# Altium schematic sheet DS_NEW.SchDoc
size A3
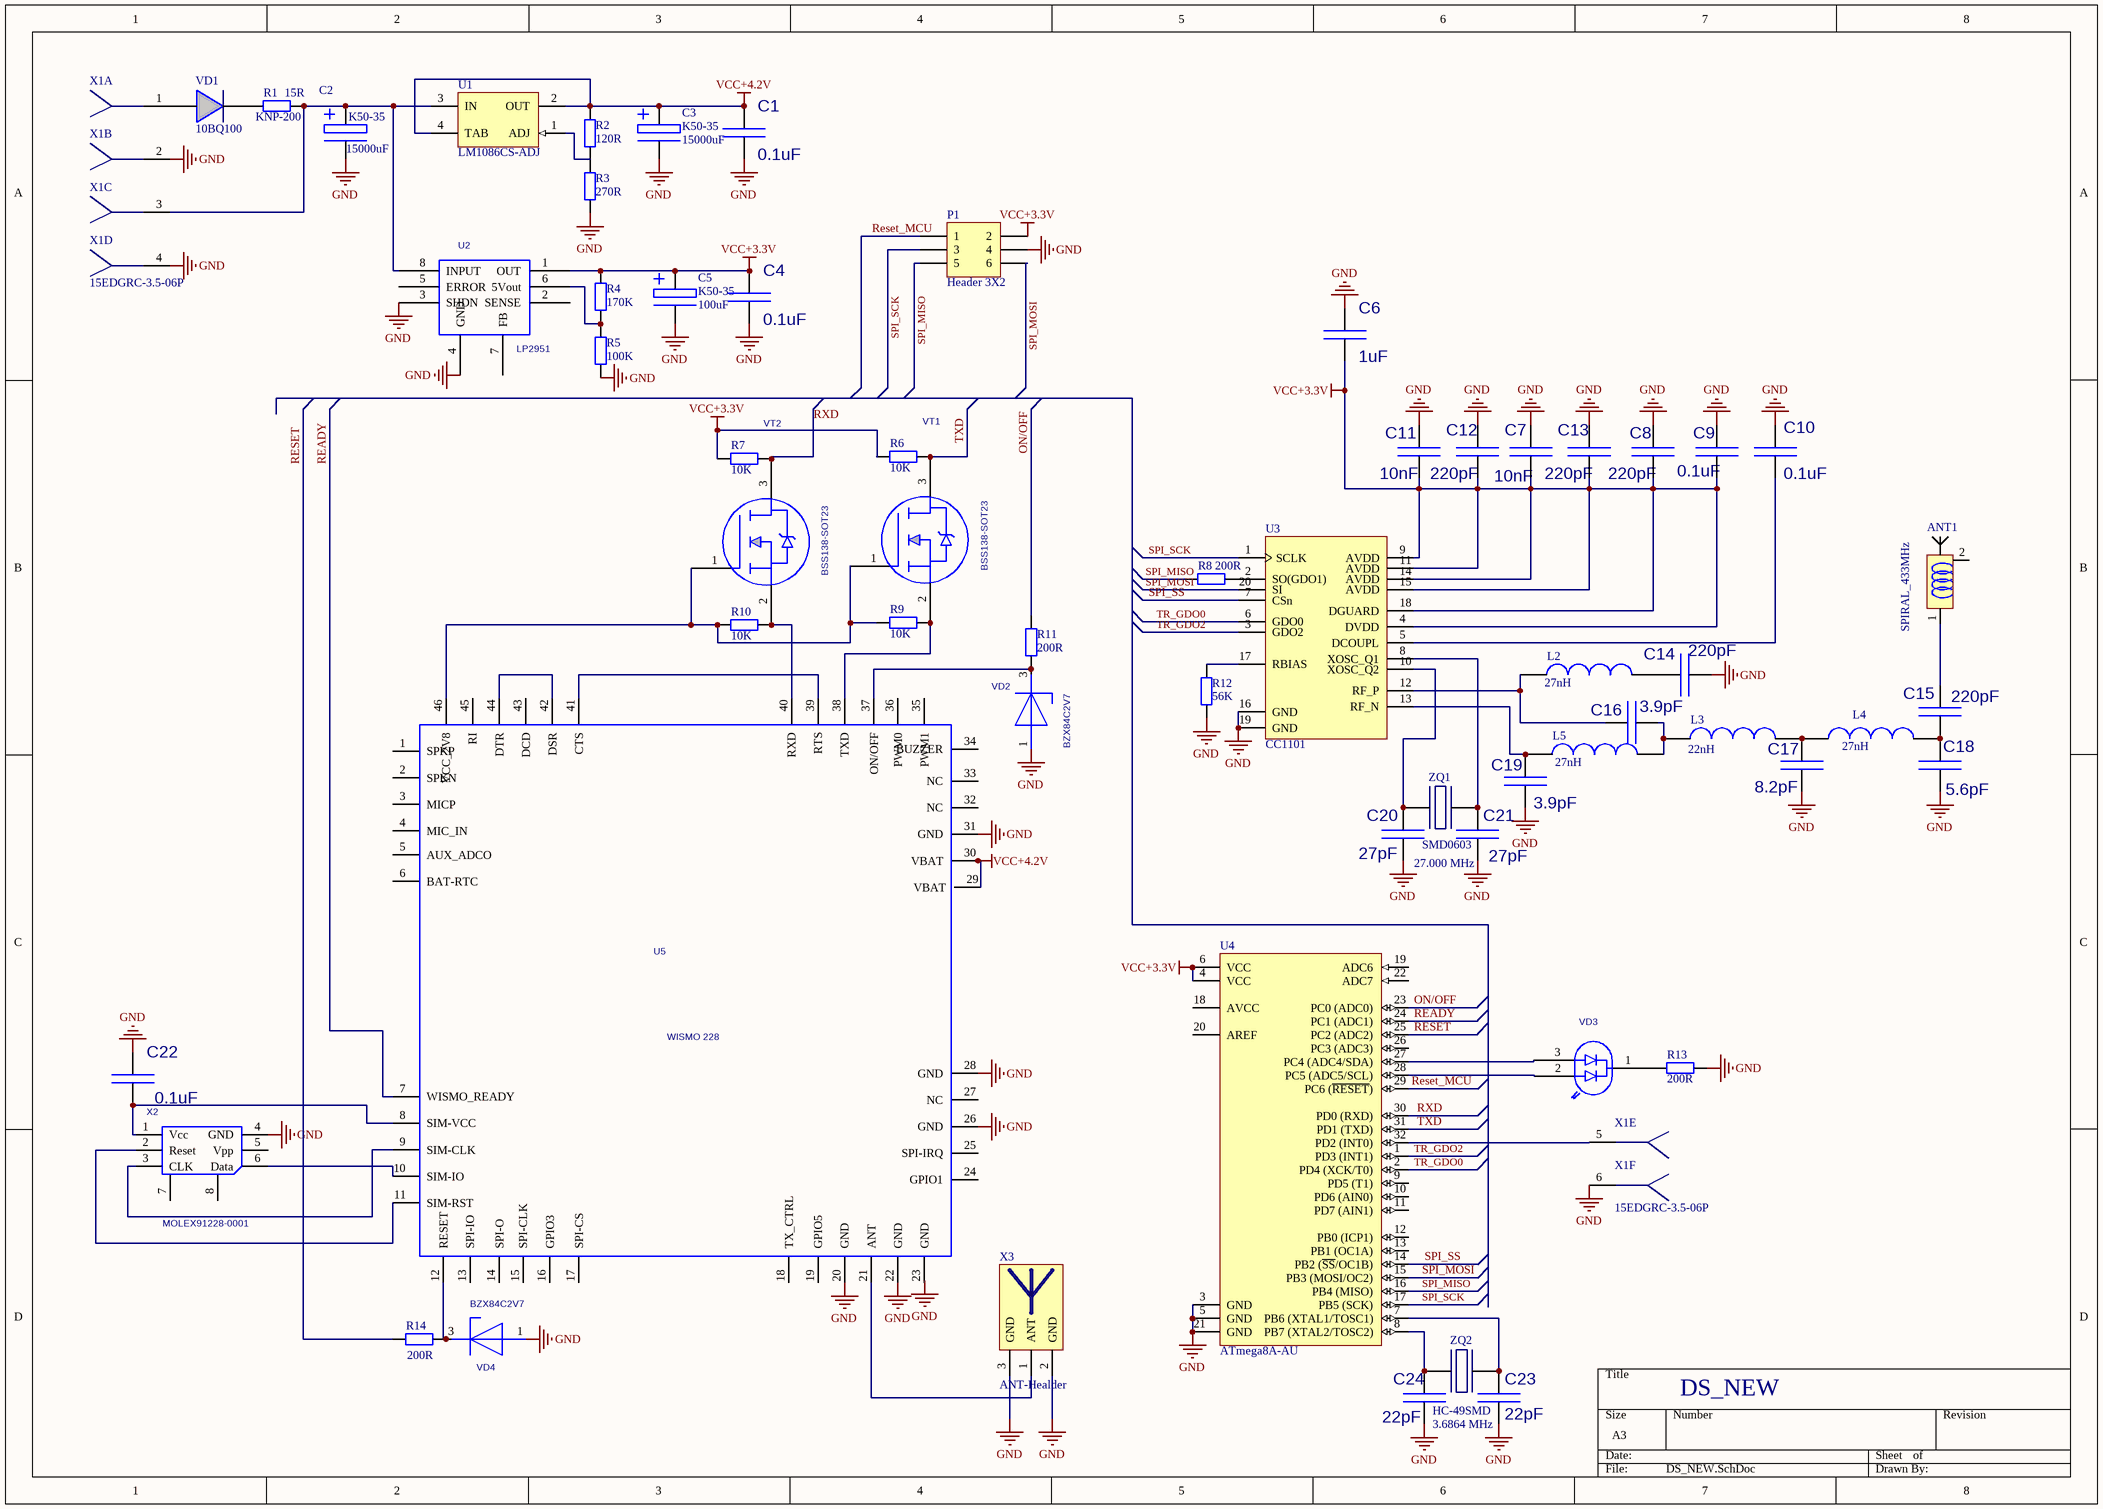
[diagram p0: DS_NEW.SchDoc]

## Parts
ANT1  SPIRAL_433MHz  [ANT_433MHz_SPIRAL]
C1  value 0.1uF  [C0805]  (hidden comment: KONDENS_SMD)
C2  K50-35  [CAP_POL_D18-Horizontal]
C3  K50-35  [CAP_POL_D18-Horizontal]
C4  value 0.1uF  [C0805]  (hidden comment: KONDENS_SMD)
C5  K50-35  value 100uF  [CAP_POL_D6.3]
C6  value 1uF  [C0805]  (hidden comment: KONDENS_SMD)
C7  value 10nF  [C0805]  (hidden comment: KONDENS_SMD)
C8  value 220pF  [C0805]  (hidden comment: KONDENS_SMD)
C9  value 0.1uF  [C0805]  (hidden comment: KONDENS_SMD)
C10  value 0.1uF  [C0805]  (hidden comment: KONDENS_SMD)
C11  value 10nF  [C0805]  (hidden comment: KONDENS_SMD)
C12  value 220pF  [C0805]  (hidden comment: KONDENS_SMD)
C13  value 220pF  [C0805]  (hidden comment: KONDENS_SMD)
C14  value 220pF  [C0805]  (hidden comment: KONDENS_SMD)
C15  value 220pF  [C0805]  (hidden comment: KONDENS_SMD)
C16  value 3.9pF  [C0805]  (hidden comment: KONDENS_SMD)
C17  value 8.2pF  [C0805]  (hidden comment: KONDENS_SMD)
C18  value 5.6pF  [C0805]  (hidden comment: KONDENS_SMD)
C19  value 3.9pF  [C0805]  (hidden comment: KONDENS_SMD)
C20  value 27pF  [C0805]  (hidden comment: KONDENS_SMD)
C21  value 27pF  [C0805]  (hidden comment: KONDENS_SMD)
C22  value 0.1uF  [C0805]  (hidden comment: KONDENS_SMD)
C23  value 22pF  [C0805]  (hidden comment: KONDENS_SMD)
C24  value 22pF  [C0805]  (hidden comment: KONDENS_SMD)
L2  value 27nH  [6-0805_M]  (hidden comment: SMD_0805)
L3  value 22nH  [6-0805_M]  (hidden comment: SMD_0805)
L4  value 27nH  [6-0805_M]  (hidden comment: SMD_0805)
L5  value 27nH  [6-0805_M]  (hidden comment: SMD_0805)
P1  Header 3X2  [HDR2X3]
R1  KNP-200  [Resistor KNP-200]
R2  value 120R  [C0805]  (hidden comment: RES)
R3  value 270R  [C0805]  (hidden comment: RES)
R4  value 170K  [C0805]  (hidden comment: RES)
R5  value 100K  [C0805]  (hidden comment: RES)
R6  value 10K  [C0805]  (hidden comment: RES)
R7  value 10K  [C0805]  (hidden comment: RES)
R8  value 200R  [C0805]  (hidden comment: RES)
R9  value 10K  [C0805]  (hidden comment: RES)
R10  value 10K  [C0805]  (hidden comment: RES)
R11  value 200R  [C0805]  (hidden comment: RES)
R12  value 56K  [C0805]  (hidden comment: RES)
R13  value 200R  [C0805]  (hidden comment: RES)
R14  value 200R  [C0805]  (hidden comment: RES)
U1  LM1086CS-ADJ  [TS3B_M]
U2  LP2951  [SOIC-8]
U3  CC1101  [VQFN20]
U4  ATmega8A-AU  [32A_N]
U5  WISMO 228  [WISMO]
VD1  10BQ100  [SMB]
VD2  BZX84C2V7  [SOT23]
VD3  LIGHTDIODE2  [LIGHTDIODE2]  (value not drawn)
VD4  BZX84C2V7  [SOT23]
VT1  BSS138-SOT23  [SOT23]
VT2  BSS138-SOT23  [SOT23]
X1  15EDGRC-3.5-06P  [15EDGRC-3.5-06P]  (value not drawn)  (parts A,B,C,D,E,F of 6)
X2  MOLEX91228-0001  [MOLEX91228-0001]
X3  ANT-Healder  [ANT-Healder]
ZQ1  SMD0603  value 27.000 MHz  [Quartz_SMD0603]
ZQ2  HC-49SMD  value 3.6864 MHz  [HC-49SMD]

## Nets
GND: C1.2(B) C2.2(MINUS) C3.2(MINUS) C4.2(B) C5.2(MINUS) C6.1(A) C7.1(A) C8.1(A) C9.1(A) C10.1(A) C11.1(A) C12.1(A) C13.1(A) C14.2(B) C17.2(B) C18.2(B) C19.2(B) C20.2(B) C21.2(B) C22.1(A) C23.2(B) C24.2(B) P1.4 R3.1 R5.1 R12.1 R13.1 U2.3(SHDN) U2.4(GND) U3.16(GND) U3.19(GND) U4.3(GND) U4.5(GND) U4.21(GND) U5.20(GND) U5.22(GND) U5.26(GND) U5.28(GND) U5.31(GND) VD2.1 VD4.1 X1.2 X1.4 X1.6 X2.4(GND) X3.2(GND) X3.3(GND)
VCC+3.3V: C4.1(A) C5.1(PLUS) C6.2(B) C7.2(B) C8.2(B) C9.2(B) C11.2(B) C12.2(B) C13.2(B) P1.2 R4.2 R6.2 R7.2 U2.1(OUT) U3.4(DVDD) U3.9(AVDD) U3.11(AVDD) U3.14(AVDD) U3.15(AVDD) U3.18(DGUARD) U4.4(VCC) U4.6(VCC)
VCC+4.2V: C1.1(A) C3.1(PLUS) R2.2 U1.2(OUT) U1.4(TAB) U5.29(VBAT) U5.30(VBAT)
ON/OFF: R11.2 U4.23(PC0_(ADC0))
READY: U4.24(PC1_(ADC1)) U5.7(WISMO_READY)
RESET: R14.2 U4.25(PC2_(ADC2))
Reset_MCU: P1.1 U4.29(PC6_(~{RESET}))
RXD: R7.1 U4.30(PD0_(RXD)) VT2.3(Drain)
SPI_MISO: P1.5 R8.2 U4.16(PB4_(MISO))
SPI_MOSI: P1.6 U3.20(SI) U4.15(PB3_(MOSI/OC2))
SPI_SCK: P1.3 U3.1(SCLK) U4.17(PB5_(SCK))
SPI_SS: U3.7(CSn) U4.14(PB2_(~{SS}/OC1B))
TR_GDO0: U3.6(GDO0) U4.2(PD4_(XCK/T0))
TR_GDO2: U3.3(GDO2) U4.1(PD3_(INT1))
TXD: R6.1 U4.31(PD1_(TXD)) VT1.3(Drain)
NetANT1_1: ANT1.1 C15.1(A)
NetC2_1: C2.1(PLUS) R1.2 U1.3(IN) U2.8(INPUT) X1.3
NetC10_2: C10.2(B) U3.5(DCOUPL)
NetC14_1: C14.1(A) L2.2
NetC15_2: C15.2(B) C18.1(A) L4.2
NetC16_1: C16.1(A) L2.1 U3.12(RF_P)
NetC16_2: C16.2(B) L3.1 L5.2
NetC17_1: C17.1(A) L3.2 L4.1
NetC19_1: C19.1(A) L5.1 U3.13(RF_N)
NetC20_1: C20.1(A) U3.10(XOSC_Q2) ZQ1.3
NetC21_1: C21.1(A) U3.8(XOSC_Q1) ZQ1.1
NetC22_2: C22.2(B) U5.8(SIM-VCC) X2.1(Vcc)
NetC23_1: C23.1(A) U4.7(PB6_(XTAL1/TOSC1)) ZQ2.1
NetC24_1: C24.1(A) U4.8(PB7_(XTAL2/TOSC2)) ZQ2.2
NetR1_1: R1.1 VD1.1
NetR3_2: R3.2 U1.1(ADJ)
NetR4_1: R4.1 R5.2 U2.6(5Vout)
NetR8_1: R8.1 U3.2(SO(GDO1))
NetR9_1: R9.1 U5.38(TXD) VT1.2(Source)
NetR9_2: R9.2 R10.2 U5.46(VCC_2V8) VT1.1(Gate) VT2.1(Gate)
NetR10_1: R10.1 U5.40(RXD) VT2.2(Source)
NetR11_1: R11.1 U5.37(ON/OFF) VD2.3
NetR12_2: R12.2 U3.17(RBIAS)
NetR13_2: R13.2 VD3.1
NetR14_1: R14.1 U5.12(RESET) VD4.3
NetU4_27: U4.27(PC4_(ADC4/SDA)) VD3.3
NetU4_28: U4.28(PC5_(ADC5/SCL)) VD3.2
NetU4_32: U4.32(PD2_(INT0)) X1.5
NetU5_9: U5.9(SIM-CLK) X2.3(CLK)
NetU5_10: U5.10(SIM-IO) X2.6(Data)
NetU5_11: U5.11(SIM-RST) X2.2(Reset)
NetU5_21: U5.21(ANT) X3.1(ANT)
NetU5_39: U5.39(RTS) U5.41(CTS)
NetU5_42: U5.42(DSR) U5.44(DTR)
NetVD1_2: VD1.2 X1.1

Not connected (* = marked no-connect by the designer): ANT1 2; R2 1; U2 2(SENSE) 5(ERROR) 7(FB); U4 9(PD5_(T1)) 10(PD6_(AIN0)) 11(PD7_(AIN1)) 12(PB0_(ICP1)) 13(PB1_(OC1A)) 18(AVCC) 19(ADC6) 20(AREF) 22(ADC7) 26(PC3_(ADC3)); U5 1(SPKP) 2(SPKN) 3(MICP) 4(MIC_IN) 5(AUX_ADCO) 6(BAT-RTC) 13(SPI-IO) 14(SPI-O) 15(SPI-CLK) 16(GPIO3) 17(SPI-CS) 18(TX_CTRL) 19(GPIO5) 23(GND) 24(GPIO1) 25(SPI-IRQ) 27(NC) 32(NC) 33(NC) 34(BUZZER) 35(PWM1) 36(PWM0) 43(DCD) 45(RI); VD2 2; VD4 2; X2 5(Vpp) 7(0) 8(1)

## Notes on the sheet
- DS_NEW
- Labels drawn without touching a wire or pin: GND
- (in symbol Capasitor _pol D18) 15000uF
- (in symbol Resistor 2W) 15R

## Library data of the parts
ANT1 = ANT_433MHz_SPIRAL
C2 C3 = Capasitor _pol D18
C5 = Capasitor_pol D6.3
L2-L5 = Induktor_0805
P1 = Header 3X2: Header, 3-Pin, Dual row; LatestRevisionDate: 17-Jul-2002; LatestRevisionNote: Re-released for DXP Platform.; Publisher: Altium Limited
R1 = Resistor 2W
R2-R14 = RES: Resistor
U1 = LM1086CS-ADJ: 1.5A Low Dropout Positive Regulators, 3-pin TO-263; Manufacturer: National Semiconductor; PackageTopMarking: NSUZXYTTE#*LM1086*CS-ADJ; PowerWise: N; CompType: LDO IC; Published: 4-Dec-2008; DatasheetVersion: Jun-2005; PackageVersion: revF, Apr-2005; PackageReference: TS3B; Publisher: Altium Limited; PackageDescription: TO-263, Molded, .400 x .390 x .180in, 3 Lead, .1in Pitch, Surface Mount; Supplier 1: Farnell; Supplier Part Number 1: 9489975; PartNumber: LM1086CS-ADJ; RoHS: N; PinCount: 3; Code_JEDEC: MO-169-AA; ComponentLink1Description: LM1086 Datasheet; ComponentLink1URL: http://www.national.com/ds/LM/LM1086.pdf; ComponentLink2Description: LM1086 Web Page; ComponentLink2URL: http://www.national.com/pf/LM/LM1086.html; ComponentLink3Description: TS3B Package Page; ComponentLink3URL: http://www.national.com/packaging/folders/ts3b.html
U4 = ATmega8A-AU: 8-bit AVR Microcontroller, 8KB Flash, 512 Bytes EEPROM, 1KB SRAM, 32-pin TQFP, Industrial Grade (-40°C to 85°C); Published: 1-Apr-2010; DatasheetVersion: revC, Jul-2009; PackageVersion: revB, Oct-2001; PackageReference: 32A; Publisher: Altium Limited; PackageDescription: 32-Lead, 7x7x1.0 mm Body, 0.8mm Lead Pitch, Thin Profile Plastic Quad Flat Package (TQFP); Supplier 1: Digi-Key; Supplier Part Number 1: ATMEGA8A-AU-ND; Supplier 2: Farnell; Supplier Part Number 2: 1748532; Supplier 3: Mouser; Supplier Part Number 3: 556-ATMEGA8A-AU; Code_JEDEC: MS-026-ABA; ComponentLink1Description: Manufacturer Link; ComponentLink1URL: http://www.atmel.com/products/avr/default.asp?; ComponentLink2Description: ATmega8A Datasheet; ComponentLink2URL: http://www.atmel.com/dyn/resources/prod_documents/doc8159.pdf; ComponentLink3Description: ATmega8A Summary; ComponentLink3URL: http://www.atmel.com/dyn/resources/prod_documents/8159S.pdf; ComponentLink4Description: Atmel.com Home; ComponentLink4URL: http://www.atmel.com
X3 = ANT_HELDER
ZQ1 = Quartz_SMD0603
U2 = LP2951: Value: *
U5 = WISMO 228: Value: *
VD2 VD4 = BZX84C2V7: Value: *
VD3 = LIGHTDIODE2: Value: *
VT1 VT2 = BSS138-SOT23: Value: *
X2 = MOLEX91228-0001: Value: *